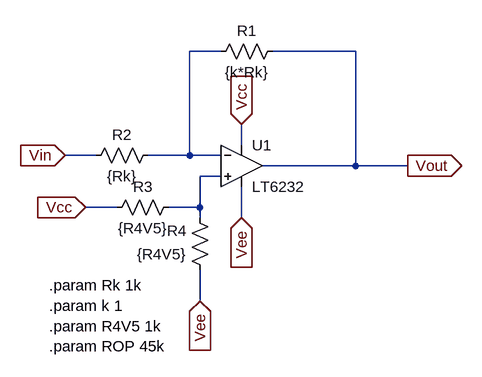
[diagram p0: schematic InverterOp.asc]
InverterOp.asc, the LTspice schematic file:
Version 4
SHEET 1 880 680
WIRE 128 32 80 32
WIRE 336 32 208 32
WIRE 160 176 160 144
WIRE -64 192 -112 192
WIRE 80 192 80 32
WIRE 80 192 16 192
WIRE 128 192 80 192
WIRE 336 208 336 32
WIRE 336 208 192 208
WIRE 416 208 336 208
WIRE 128 224 96 224
WIRE -32 272 -80 272
WIRE 96 272 96 224
WIRE 96 272 48 272
WIRE 96 288 96 272
WIRE 160 288 160 240
WIRE 96 416 96 368
FLAG 160 144 Vcc
IOPIN 160 144 In
FLAG 160 288 Vee
IOPIN 160 288 In
FLAG -80 272 Vcc
IOPIN -80 272 In
FLAG 96 416 Vee
IOPIN 96 416 In
FLAG 416 208 Vout
IOPIN 416 208 Out
FLAG -112 192 Vin
IOPIN -112 192 In
SYMBOL Opamps\\LT6232 160 208 R0
SYMATTR InstName U1
SYMBOL res 112 48 R270
WINDOW 0 32 56 VTop 2
WINDOW 3 0 56 VBottom 2
SYMATTR InstName R1
SYMATTR Value {k*Rk}
SYMBOL res -80 208 R270
WINDOW 0 32 56 VTop 2
WINDOW 3 0 56 VBottom 2
SYMATTR InstName R2
SYMATTR Value {Rk}
SYMBOL res 64 256 R90
WINDOW 0 0 56 VBottom 2
WINDOW 3 32 56 VTop 2
SYMATTR InstName R3
SYMATTR Value {R4V5}
SYMBOL res 112 384 R180
WINDOW 0 36 76 Left 2
WINDOW 3 36 40 Left 2
SYMATTR InstName R4
SYMATTR Value {R4V5}
TEXT -136 392 Left 2 !.param Rk 1k\n.param k 1\n.param R4V5 1k\n.param ROP 45k

The netlist it stands for:
* InverterOp.asc
* U1: LT6232 (symbol Opamps\LT6232 not available, pins judged from their places): In+=N002 In-=N001 V+=Vcc V-=Vee OUT=Vout
R1 N001 Vout {k*Rk}
R2 Vin N001 {Rk}
R3 N002 Vcc {R4V5}
R4 Vee N002 {R4V5}
.param Rk 1k
.param k 1
.param R4V5 1k
.param ROP 45k
.backanno
.end